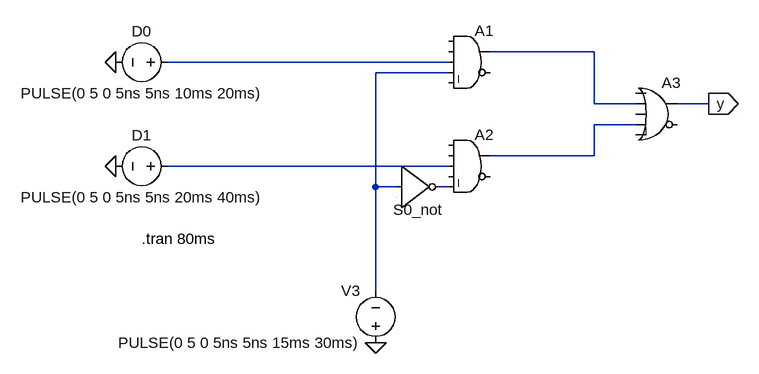
[diagram p0: schematic mux.asc]
mux.asc, the LTspice schematic file:
Version 4
SHEET 1 880 680
WIRE 400 48 240 48
WIRE 176 64 -256 64
WIRE 176 80 64 80
WIRE 400 128 400 48
WIRE 464 128 400 128
WIRE 576 128 528 128
WIRE 464 160 400 160
WIRE 400 208 400 160
WIRE 400 208 240 208
WIRE 176 224 -256 224
WIRE 64 256 64 80
WIRE 96 256 64 256
WIRE 176 256 160 256
WIRE 64 416 64 256
FLAG -336 64 0
FLAG -336 224 0
FLAG 64 496 0
FLAG 576 128 y
IOPIN 576 128 Out
SYMBOL Digital\\and 208 0 R0
SYMATTR InstName A1
SYMBOL Digital\\and 208 160 R0
SYMATTR InstName A2
SYMBOL Digital\\or 496 80 R0
SYMATTR InstName A3
SYMBOL voltage -240 64 R90
WINDOW 0 -32 56 VBottom 2
WINDOW 3 32 56 VTop 2
WINDOW 123 0 0 Left 0
WINDOW 39 0 0 Left 0
SYMATTR InstName D0
SYMATTR Value PULSE(0 5 0 5ns 5ns 10ms 20ms)
SYMBOL voltage -240 224 R90
WINDOW 0 -32 56 VBottom 2
WINDOW 3 32 56 VTop 2
WINDOW 123 0 0 Left 0
WINDOW 39 0 0 Left 0
SYMATTR InstName D1
SYMATTR Value PULSE(0 5 0 5ns 5ns 20ms 40ms)
SYMBOL voltage 64 512 R180
WINDOW 0 24 96 Left 2
WINDOW 3 24 16 Left 2
WINDOW 123 0 0 Left 0
WINDOW 39 0 0 Left 0
SYMATTR InstName V3
SYMATTR Value PULSE(0 5 0 5ns 5ns 15ms 30ms)
SYMBOL Digital\\inv 96 192 R0
WINDOW 0 -5 99 Left 2
SYMATTR InstName S0_not
TEXT -296 336 Left 2 !.tran 80ms

The netlist it stands for:
* mux.asc
A1 0 0 N002 N003 0 0 N001 0 AND
A2 0 0 N005 0 N006 0 N004 0 AND
A3 0 N001 0 N004 0 0 y 0 OR
V§D0 N002 0 PULSE(0 5 0 5ns 5ns 10ms 20ms)
V§D1 N005 0 PULSE(0 5 0 5ns 5ns 20ms 40ms)
V3 0 N003 PULSE(0 5 0 5ns 5ns 15ms 30ms)
A§S0_not N003 0 0 0 0 N006 0 0 BUF
.tran 80ms
.backanno
.end